# Altium schematic sheet Schema.SchDoc: PREN-ET BLDC
size A3; Date: 09.12.2011; DrawnBy: PREN-ET - ystuder / daniw; Engineer: PREN-ET - ystuder / daniw; Revision: 1.0; SheetNumber: 1; SheetTotal: 1; Projektname: BLDC; DocumentName: PREN-ET BLDC
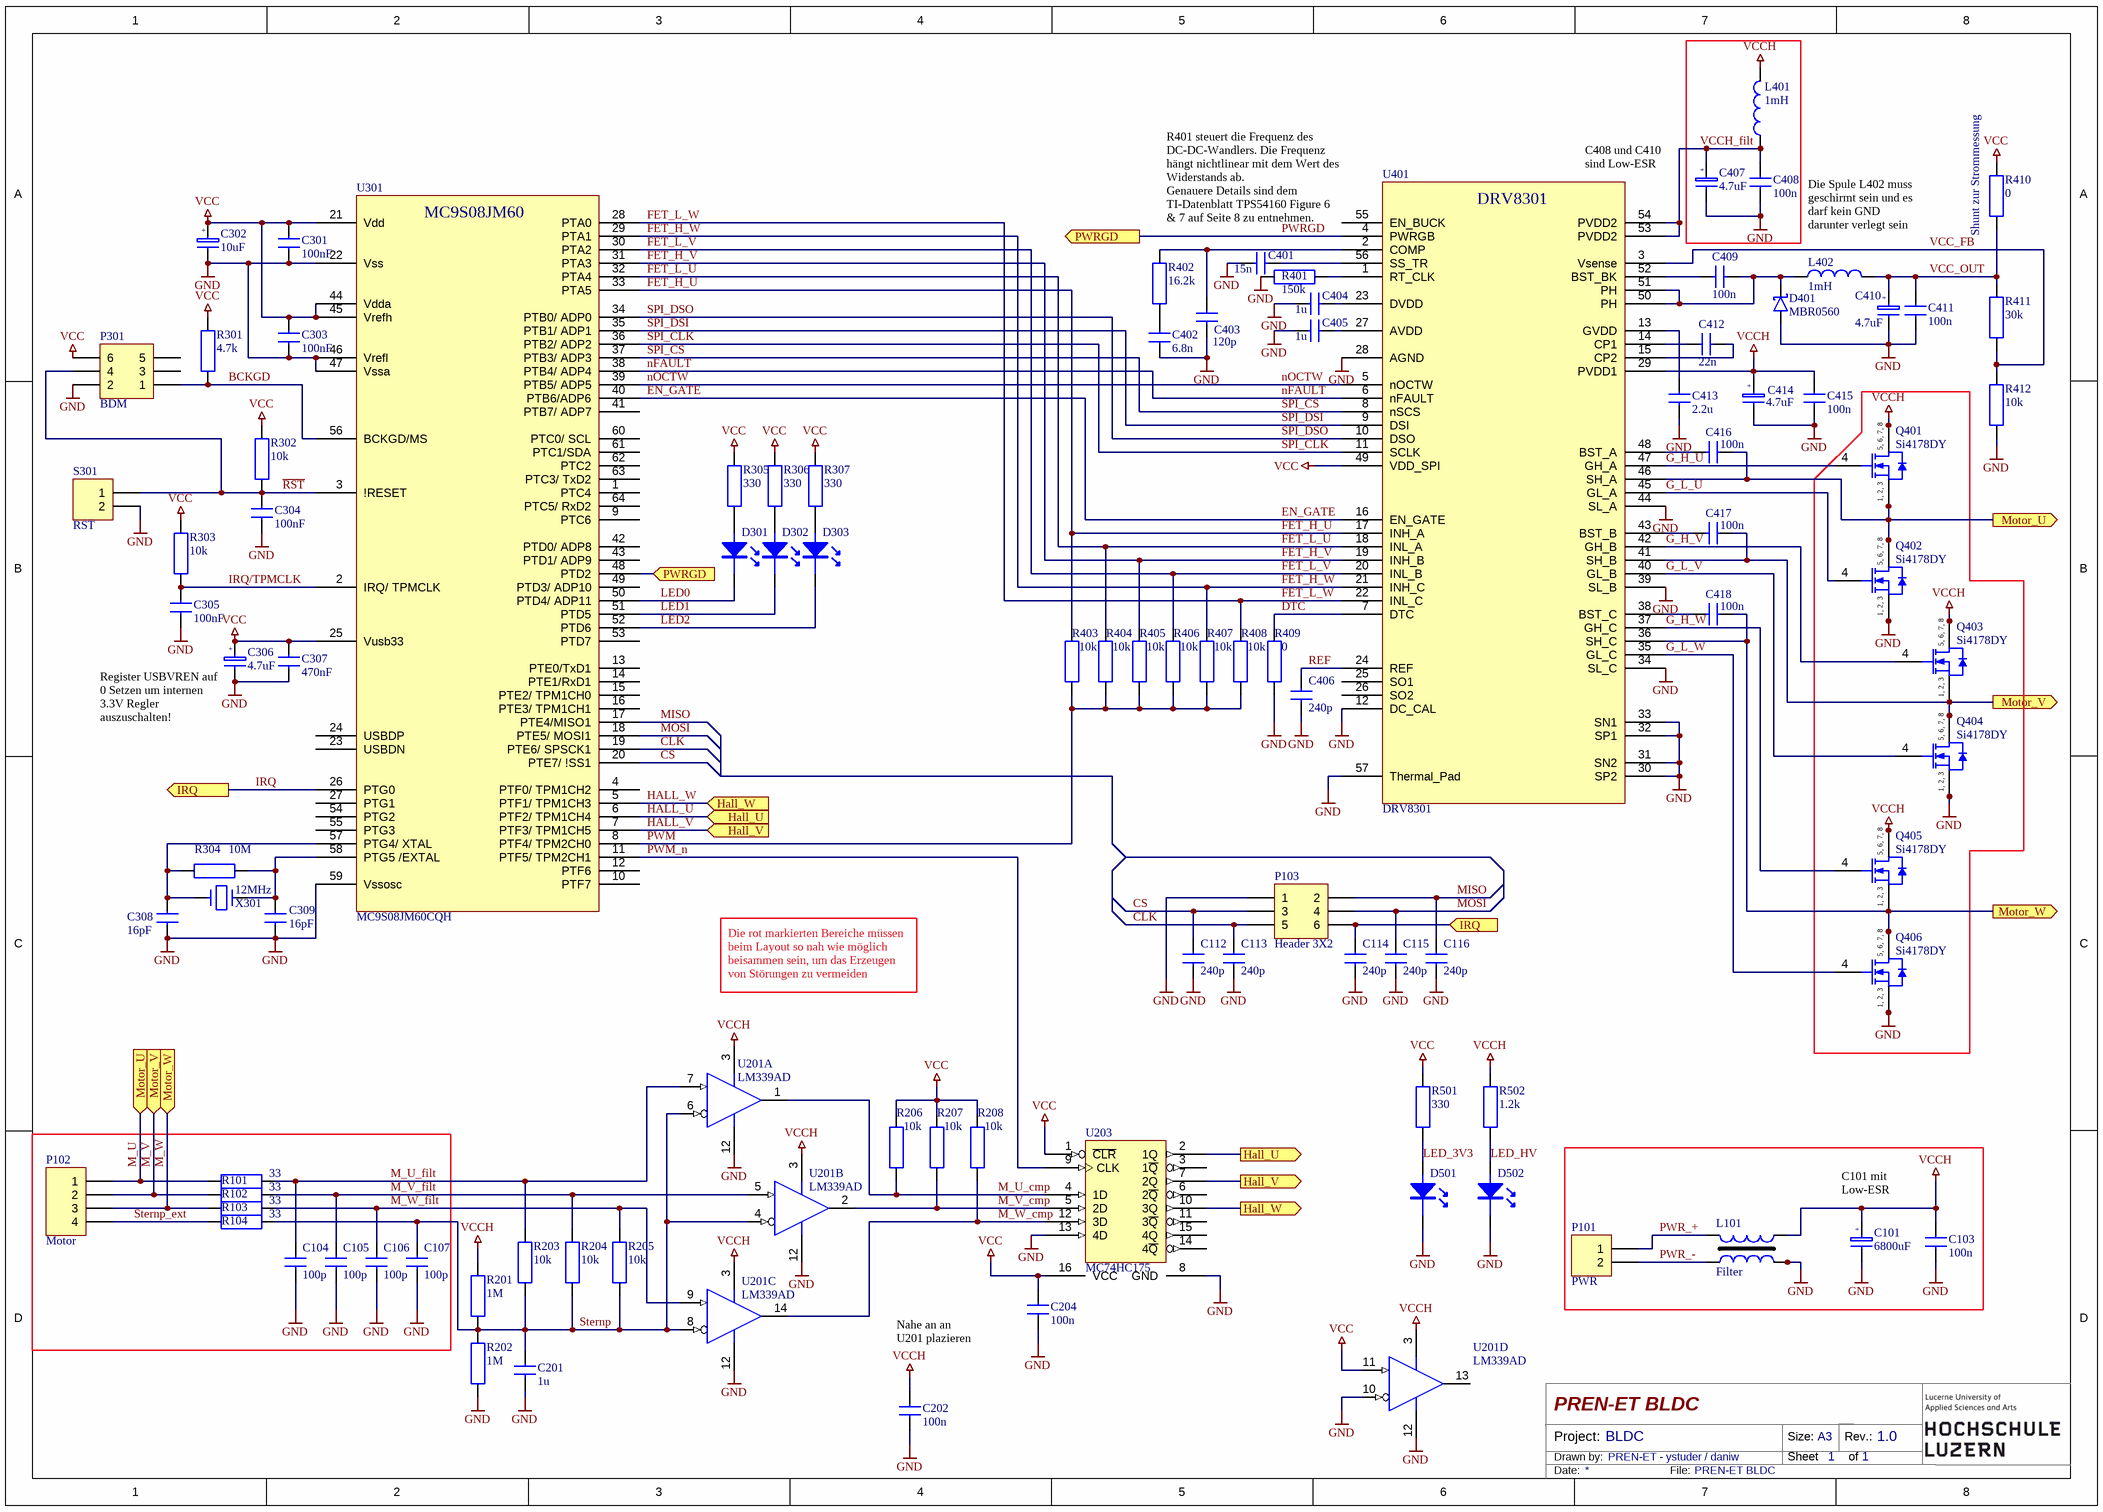
[diagram p0: Schema.SchDoc]

## Parts
C101  6800uF  [CAPPA14.05-10.5x6.3]
C103  100n  [0805]
C104  100p  [0805]
C105  100p  [0805]
C106  100p  [0805]
C107  100p  [0805]
C112  240p  [0805]
C113  240p  [0805]
C114  240p  [0805]
C115  240p  [0805]
C116  240p  [0805]
C201  1u  [0805]
C202  100n  [0805]
C204  100n  [0805]
C301  100nF  [0805]
C302  10uF  [1206]
C303  100nF  [0805]
C304  100nF  [0805]
C305  100nF  [0805]
C306  4.7uF  [1206]
C307  470nF  [0805]
C308  16pF  [0805]
C309  16pF  [0805]
C401  15n  [0805]
C402  6.8n  [0805]
C403  120p  [0805]
C404  1u  [0805]
C405  1u  [0805]
C406  240p  [0805]
C407  4.7uF  [1206]
C408  100n  [0805]
C409  100n  [0805]
C410  4.7uF  [1206]
C411  100n  [0805]
C412  22n  [0805]
C413  2.2u  [0805]
C414  4.7uF  [1206]
C415  100n  [0805]
C416  100n  [0805]
C417  100n  [0805]
C418  100n  [0805]
D301  LED  [0805]  (value not drawn)
D302  LED  [0805]  (value not drawn)
D303  LED  [0805]  (value not drawn)
D401  MBR0560  [SOD-123]
D501  LED  [0805]  (value not drawn)
D502  LED  [0805]  (value not drawn)
L101  Filter  [BNX]
L401  1mH  [SRR6603]
L402  1mH  [SRR6603]
P101  PWR  [Stecker_1x2_200mil]
P102  Motor  [Stecker_1x4_200mil]
P103  Header 3X2  [HDR2X3]
P301  BDM  [HDR2X3]
Q401  Si4178DY  [SO-8_N]
Q402  Si4178DY  [SO-8_N]
Q403  Si4178DY  [SO-8_N]
Q404  Si4178DY  [SO-8_N]
Q405  Si4178DY  [SO-8_N]
Q406  Si4178DY  [SO-8_N]
R101  33  [0805]
R102  33  [0805]
R103  33  [0805]
R104  33  [0805]
R201  1M  [0805]
R202  1M  [0805]
R203  10k  [0805]
R204  10k  [0805]
R205  10k  [0805]
R206  10k  [0805]
R207  10k  [0805]
R208  10k  [0805]
R301  4.7k  [0805]
R302  10k  [0805]
R303  10k  [0805]
R304  10M  [0805]
R305  330  [0805]
R306  330  [0805]
R307  330  [0805]
R401  150k  [0805]
R402  16.2k  [0805]
R403  10k  [0805]
R404  10k  [0805]
R405  10k  [0805]
R406  10k  [0805]
R407  10k  [0805]
R408  10k  [0805]
R409  0  [0805]
R410  0  [0805]
R411  30k  [0805]
R412  10k  [0805]
R501  330  [0805]
R502  1.2k  [0805]
S301  RST  [HDR1X2]
U201  LM339AD  [D014_L]  (parts A,B,C,D of 4)
U203  MC74HC175  [SO-16]
U301  MC9S08JM60CQH  [QFP64(14x14)]
U401  DRV8301  [HTSSOP56]
X301  12MHz  [HC/49US]

## Ports
Hall_U (in), Hall_U (out), Hall_V (in), Hall_V (out), Hall_W (in), Hall_W (out), IRQ (in), IRQ (out), Motor_U (in), Motor_U (out), Motor_V (in), Motor_V (out), Motor_W (in), Motor_W (out), PWRGD (in), PWRGD (out)

## Nets
GND: C101.2 C103.2 C104.2 C105.2 C106.2 C107.2 C112.2 C113.2 C114.2 C115.2 C116.2 C201.2 C202.2 C204.2 C301.2 C302.2 C303.2 C304.2 C305.2 C306.2 C307.2 C308.1 C309.1 C401.1 C402.2 C403.2 C404.2 C405.2 C406.2 C407.2 C408.2 C410.2 C411.2 C413.2 C414.2 C415.1 D401.A D501.1 D502.1 L101.3 L101.4 L101.6 P103.1 P301.2 Q402.1(S) Q402.2(S) Q402.3(S) Q404.1(S) Q404.2(S) Q404.3(S) Q406.1(S) Q406.2(S) Q406.3(S) R202.1 R401.2 R409.1 R412.1 S301.2 U201.10(IN-) U201.12(GND) U203.8(GND) U203.13(4D) U301.22(Vss) U301.46(Vrefl) U301.47(Vssa) U301.59(Vssosc) U401.12(DC_CAL) U401.28(AGND) U401.30(SP2) U401.31(SN2) U401.32(SP1) U401.33(SN1) U401.34(SL_C) U401.39(SL_B) U401.44(SL_A) U401.57(Thermal_Pad)
VCC: C204.1 C301.1 C302.1 C303.1 C306.1 C307.1 P301.6 R206.2 R207.2 R208.2 R301.1 R302.1 R303.1 R305.2 R306.2 R307.2 R410.1 R501.2 U201.11(IN+) U203.1(~{CLR}) U203.16(VCC) U301.21(Vdd) U301.25(Vusb33) U301.44(Vdda) U301.45(Vrefh) U401.49(VDD_SPI)
VCCH: C101.1 C103.1 C202.1 C414.1 C415.2 L101.5 L401.2 Q401.5(D) Q401.6(D) Q401.7(D) Q401.8(D) Q403.5(D) Q403.6(D) Q403.7(D) Q403.8(D) Q405.5(D) Q405.6(D) Q405.7(D) Q405.8(D) R201.2 R502.2 U201.3(VCC) U401.29(PVDD1)
BCKGD: P301.1 R301.2 U301.56(BCKGD/MS)
CLK: C113.1 P103.5 U301.19(PTE6/_SPSCK1)
CS: C112.1 P103.3 U301.20(PTE7/_!SS1)
DTC: R409.2 U401.7(DTC)
EN_GATE: U301.40(PTB6/ADP6) U401.16(EN_GATE)
FET_H_U: R403.2 U301.33(PTA5) U401.17(INH_A)
FET_H_V: R405.2 U301.31(PTA3) U401.19(INH_B)
FET_H_W: R407.2 U301.29(PTA1) U401.21(INH_C)
FET_L_U: R404.2 U301.32(PTA4) U401.18(INL_A)
FET_L_V: R406.2 U301.30(PTA2) U401.20(INL_B)
FET_L_W: R408.2 U301.28(PTA0) U401.22(INL_C)
G_H_U: Q401.4(G) U401.47(GH_A)
G_H_V: Q403.4(G) U401.42(GH_B)
G_H_W: Q405.4(G) U401.37(GH_C)
G_L_U: Q402.4(G) U401.45(GL_A)
G_L_V: Q404.4(G) U401.40(GL_B)
G_L_W: Q406.4(G) U401.35(GL_C)
HALL_U: U203.2(1Q) U301.6(PTF2/_TPM1CH4) ; port Hall_U
HALL_V: U203.7(2Q) U301.7(PTF3/_TPM1CH5) ; port Hall_V
HALL_W: U203.10(3Q) U301.5(PTF1/_TPM1CH3) ; port Hall_W
IRQ: C114.1 P103.6 U301.26(PTG0) ; port IRQ
IRQ/TPMCLK: C305.1 R303.2 U301.2(IRQ/_TPMCLK)
LED0: D301.1 U301.50(PTD4/_ADP11)
LED1: D302.1 U301.51(PTD5)
LED2: D303.1 U301.52(PTD6)
LED_3V3: D501.2 R501.1
LED_HV: D502.2 R502.1
M_U: C416.1 P102.1 Q401.1(S) Q401.2(S) Q401.3(S) Q402.5(D) Q402.6(D) Q402.7(D) Q402.8(D) R101.1 U401.46(SH_A) ; port Motor_U
M_U_cmp: R206.1 U201.1(OUT) U203.4(1D)
M_U_filt: C104.1 R101.2 R203.2 U201.7(IN+)
M_V: C417.1 P102.2 Q403.1(S) Q403.2(S) Q403.3(S) Q404.5(D) Q404.6(D) Q404.7(D) Q404.8(D) R102.1 U401.41(SH_B) ; port Motor_V
M_V_cmp: R207.1 U201.2(OUT) U203.5(2D)
M_V_filt: C105.1 R102.2 R204.2 U201.5(IN+)
M_W: C418.1 P102.3 Q405.1(S) Q405.2(S) Q405.3(S) Q406.5(D) Q406.6(D) Q406.7(D) Q406.8(D) R103.1 U401.36(SH_C) ; port Motor_W
M_W_cmp: R208.1 U201.14(OUT) U203.12(3D)
M_W_filt: C106.1 R103.2 R205.2 U201.9(IN+)
MISO: C116.1 P103.2 U301.17(PTE4/MISO1)
MOSI: C115.1 P103.4 U301.18(PTE5/_MOSI1)
nFAULT: U301.38(PTB4/_ADP4) U401.6(nFAULT)
nOCTW: U301.39(PTB5/_ADP5) U401.5(nOCTW)
PWM: R403.1 R404.1 R405.1 R406.1 R407.1 R408.1 U301.8(PTF4/_TPM2CH0)
PWM_n: U203.9(CLK) U301.11(PTF5/_TPM2CH1)
PWR_+: L101.1 P101.1
PWR_-: L101.2 P101.2
PWRGD: U301.48(PTD2) U401.4(PWRGB) ; port PWRGD
~{RST}: C304.1 P301.4 R302.2 S301.1 U301.3(!RESET)
REF: C406.1 U401.24(REF)
SPI_CLK: U301.36(PTB2/_ADP2) U401.11(SCLK)
SPI_CS: U301.37(PTB3/_ADP3) U401.8(nSCS)
SPI_DSI: U301.35(PTB1/_ADP1) U401.9(DSI)
SPI_DSO: U301.34(PTB0/_ADP0) U401.10(DSO)
Sternp: C107.1 C201.1 R104.2 R201.1 R202.2 R203.1 R204.1 R205.1 U201.4(IN-) U201.6(IN-) U201.8(IN-)
Sternp_ext: P102.4 R104.1
VCC_FB: R411.1 R412.2 U401.3(Vsense)
VCC_OUT: C410.1 C411.1 L402.2 R410.2 R411.2
VCCH_filt: C407.1 C408.1 L401.1 U401.53(PVDD2) U401.54(PVDD2)
NetC308_2: C308.2 R304.1 U301.57(PTG4/_XTAL) X301.1
NetC309_2: C309.2 R304.2 U301.58(PTG5_/EXTAL) X301.2
NetC401_2: C401.2 U401.56(SS_TR)
NetC402_1: C402.1 R402.1
NetC403_1: C403.1 R402.2 U401.2(COMP)
NetC404_1: C404.1 U401.23(DVDD)
NetC405_1: C405.1 U401.27(AVDD)
NetC409_1: C409.1 D401.K L402.1 U401.50(PH) U401.51(PH)
NetC409_2: C409.2 U401.52(BST_BK)
NetC412_1: C412.1 U401.15(CP2)
NetC412_2: C412.2 U401.14(CP1)
NetC413_1: C413.1 U401.13(GVDD)
NetC416_2: C416.2 U401.48(BST_A)
NetC417_2: C417.2 U401.43(BST_B)
NetC418_2: C418.2 U401.38(BST_C)
NetD301_2: D301.2 R305.1
NetD302_2: D302.2 R306.1
NetD303_2: D303.2 R307.1
NetR401_1: R401.1 U401.1(RT_CLK)

Not connected (* = marked no-connect by the designer): P301 3 5; U201 13(OUT); U203 3(1~{Q}) 6(2~{Q}) 11(3~{Q}) 14(4~{Q}) 15(4Q); U301 1(PTC4) 4(PTF0/_TPM1CH2) 9(PTC6) 10(PTF7) 12(PTF6) 13(PTE0/TxD1) 14(PTE1/RxD1) 15(PTE2/_TPM1CH0) 16(PTE3/_TPM1CH1) 23(USBDN) 24(USBDP) 27(PTG1) 41(PTB7/_ADP7) 42(PTD0/_ADP8) 43(PTD1/_ADP9) 49(PTD3/_ADP10) 53(PTD7) 54(PTG2) 55(PTG3) 60(PTC0/_SCL) 61(PTC1/SDA) 62(PTC2) 63(PTC3/_TxD2) 64(PTC5/_RxD2); U401 25(SO1) 26(SO2) 55(EN_BUCK)

## Notes on the sheet
- C408 und C410 sind Low-ESR
- R401 steuert die Frequenz des DC-DC-Wandlers. Die Frequenz hängt nichtlinear mit dem Wert des Widerstands ab.
  Genauere Details sind dem TI-Datenblatt TPS54160 Figure 6 & 7 auf Seite 8 zu entnehmen.
- Die Spule L402 muss geschirmt sein und es darf kein GND darunter verlegt sein
- (near R410) Shunt zur Strommessung
- (near C306) Register USBVREN auf 0 Setzen um internen 3.3V Regler auszuschalten!
- Die rot markierten Bereiche müssen beim Layout so nah wie möglich beisammen sein, um das Erzeugen von Störungen zu vermeiden
- C101 mit Low-ESR
- Nahe an an U201 plazieren
- Project:
- Drawn by:
- Size:
- Sheet
- A3
- Rev.:
- of
- Date:
- File:
- (in symbol C? ELKO) +
- (in symbol SI4412DY) 5, 6, 7, 8; 1, 2, 3

## Library data of the parts
C101 C302 C306 C407 C410 C414 = C? ELKO: Elektrolyt /polarisierter Kondensator; Distributor: Farnell; Distributor Nr.: 1457414; Price: 0.402
  C101: Value: 6800uF
  C302: Value: 10uF
  C306 C407 C410 C414: Value: 4.7uF
C103-C107 C112-C116 C201 C202 C204 C301 C303-C305 C307-C309 C401-C406 C408 C409 C411-C413 C415-C418 = C?: Normaler Kondensator
  C301 C303-C305: Value: 100nF; Distributor: Elektrowerkstatt
  C307: Value: 470nF; Distributor: Elektrowerkstatt
  C308 C309: Value: 16pF; Distributor: Farnell; Distributor Nr.: 1573938; Price: 0.15
D401 = DiodeSchottky: Schottky Diode; Value: BAT760; Distributor Nr.: 1835691; Price: 0.39; Distributor: Farnell
L101 = CommonFilter: Herstellerzeichung: BNX023-01
L401 L402 = L?: SRR1005-122K; Bestellnummer: 652-SRR1005-122K; Hersteller: Bourns; Distributor: Mouser; Hersteller-Nr.: SRR1005-122K
P101 S301 = Header 2: Header, 2-Pin; LatestRevisionDate: 17-Jul-2002; LatestRevisionNote: Re-released for DXP Platform.; Publisher: Altium Limited
P102 = Header 4: Header, 4-Pin; LatestRevisionDate: 17-Jul-2002; LatestRevisionNote: Re-released for DXP Platform.; Publisher: Altium Limited
P103 = Header 3X2: Header, 3-Pin, Dual row; LatestRevisionDate: 17-Jul-2002; LatestRevisionNote: Re-released for DXP Platform.; Publisher: Altium Limited
P301 = Header 3X2: Header, 3-Pin, Dual row; Value: 2x16kont; Distributor: Farnell; Distributor Nr.: 1248128; Price: 5.40
Q401-Q406 = SI4412DY: N-Channel 30V (D-S)  Rated MOSFET; Published: 8-Jun-2000; LatestRevisionDate: 13-Apr-2006; LatestRevisionNote: IPC-7351 Footprint Added.; DatasheetVersion: 6-Oct-1997; PackageVersion: Aug-1998; PackageReference: SO-8; Publisher: Altium Limited; PackageDescription: 8-Pin Small Outline Integrated Circuit 1.27 mm Pitch; ComponentLink1Description: Manufacturer Link; ComponentLink1URL: http://www.vishay.com/; ComponentLink2Description: Datasheet; ComponentLink2URL: http://www.vishay.com/docs/70154/70154.pdf
R101-R104 R201-R208 R301-R307 R401-R412 R501 R502 = R?: Normaler Widerstand
  R301: Value: 4.7k; Distributor: Elektrowerkstatt
  R302 R303: Value: 10k; Distributor: Elektrowerkstatt
  R304: Value: 10M; Distributor: Elektrowerkstatt
U201 = LM339AD: Quad Differential Comparator; Published: 15-Apr-2002; LatestRevisionDate: 13-Apr-2006; LatestRevisionNote: IPC-7351 Footprint Added.; DatasheetVersion: Apr-1988; PackageVersion: Jan-1998; PackageReference: D014; Publisher: Altium Limited; PackageDescription: 14-Pin Small Outline Integrated Circuit 1.27 mm Pitch; Code_IPC: SOIC127P600-14; ComponentLink1Description: Manufacturer Link; ComponentLink1URL: http://www.ti.com/; ComponentLink2Description: Datasheet; ComponentLink2URL: http://www-s.ti.com/sc/ds/lm139a.pdf
U203 = MC74HC175: QUAD D-TYPE FF CR
U301 = MC9S08JM60: MCU; Distributor: Farnell; Distributor Nr.: 1562860; Price: 6.55; Value: MC9S08JM60CQH
X301 = CRYSTAL: Value: 12MHz; Distributor Nr.: 1667016; Distributor: Farnell; Price: 1.40